# Altium schematic sheet DriverConectors.SchDoc
size A4
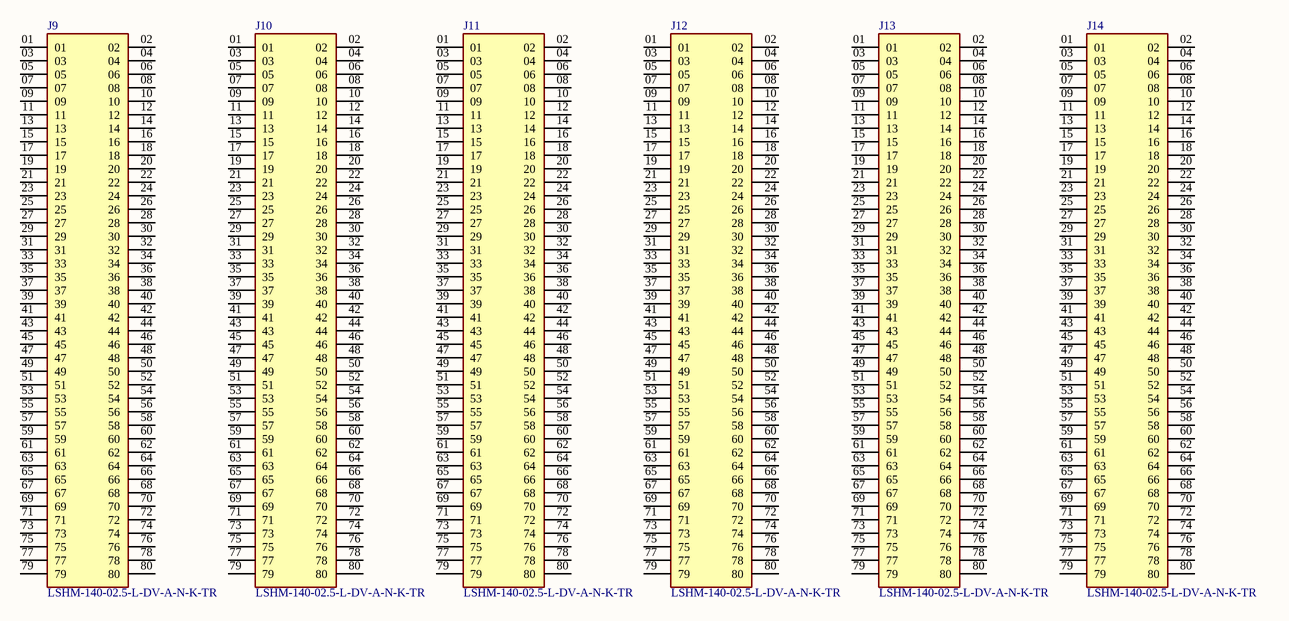
[diagram p0: DriverConectors.SchDoc]

## Parts
J9  LSHM-140-02.5-L-DV-A-N-K-TR  [SAMTEC_LSHM-140-02.5-L-DV-A-N-K-TR]
J10  LSHM-140-02.5-L-DV-A-N-K-TR  [SAMTEC_LSHM-140-02.5-L-DV-A-N-K-TR]
J11  LSHM-140-02.5-L-DV-A-N-K-TR  [SAMTEC_LSHM-140-02.5-L-DV-A-N-K-TR]
J12  LSHM-140-02.5-L-DV-A-N-K-TR  [SAMTEC_LSHM-140-02.5-L-DV-A-N-K-TR]
J13  LSHM-140-02.5-L-DV-A-N-K-TR  [SAMTEC_LSHM-140-02.5-L-DV-A-N-K-TR]
J14  LSHM-140-02.5-L-DV-A-N-K-TR  [SAMTEC_LSHM-140-02.5-L-DV-A-N-K-TR]

## Nets

Not connected (* = marked no-connect by the designer): J9 01 02 03 04 05 06 07 08 09 10 11 12 13 14 15 16 17 18 19 20 21 22 23 24 25 26 27 28 29 30 31 32 33 34 35 36 37 38 39 40 41 42 43 44 45 46 47 48 49 50 51 52 53 54 55 56 57 58 59 60 61 62 63 64 65 66 67 68 69 70 71 72 73 74 75 76 77 78 79 80; J10 01 02 03 04 05 06 07 08 09 10 11 12 13 14 15 16 17 18 19 20 21 22 23 24 25 26 27 28 29 30 31 32 33 34 35 36 37 38 39 40 41 42 43 44 45 46 47 48 49 50 51 52 53 54 55 56 57 58 59 60 61 62 63 64 65 66 67 68 69 70 71 72 73 74 75 76 77 78 79 80; J11 01 02 03 04 05 06 07 08 09 10 11 12 13 14 15 16 17 18 19 20 21 22 23 24 25 26 27 28 29 30 31 32 33 34 35 36 37 38 39 40 41 42 43 44 45 46 47 48 49 50 51 52 53 54 55 56 57 58 59 60 61 62 63 64 65 66 67 68 69 70 71 72 73 74 75 76 77 78 79 80; J12 01 02 03 04 05 06 07 08 09 10 11 12 13 14 15 16 17 18 19 20 21 22 23 24 25 26 27 28 29 30 31 32 33 34 35 36 37 38 39 40 41 42 43 44 45 46 47 48 49 50 51 52 53 54 55 56 57 58 59 60 61 62 63 64 65 66 67 68 69 70 71 72 73 74 75 76 77 78 79 80; J13 01 02 03 04 05 06 07 08 09 10 11 12 13 14 15 16 17 18 19 20 21 22 23 24 25 26 27 28 29 30 31 32 33 34 35 36 37 38 39 40 41 42 43 44 45 46 47 48 49 50 51 52 53 54 55 56 57 58 59 60 61 62 63 64 65 66 67 68 69 70 71 72 73 74 75 76 77 78 79 80; J14 01 02 03 04 05 06 07 08 09 10 11 12 13 14 15 16 17 18 19 20 21 22 23 24 25 26 27 28 29 30 31 32 33 34 35 36 37 38 39 40 41 42 43 44 45 46 47 48 49 50 51 52 53 54 55 56 57 58 59 60 61 62 63 64 65 66 67 68 69 70 71 72 73 74 75 76 77 78 79 80

## Library data of the parts
J9-J14 = LSHM-140-02.5-L-DV-A-N-K-TR: LSHM - Samtec 0.50mm Razor Beam High-Speed Hermaphroditic Terminal / Socket Strip.; Price: None; MP: LSHM-140-02.5-L-DV-A-N-K-TR; Availability: Unavailable; Value: *; Package: None